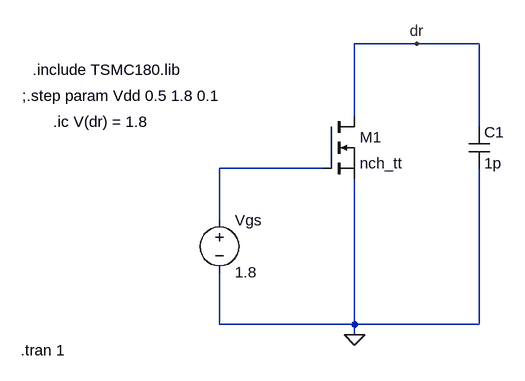
[diagram p0: schematic q1a.asc]
q1a.asc, the LTspice schematic file:
Version 4
SHEET 1 880 680
WIRE 320 0 224 0
WIRE 416 0 320 0
WIRE 224 112 224 0
WIRE 416 128 416 0
WIRE 176 192 16 192
WIRE 16 272 16 192
WIRE 16 432 16 352
WIRE 224 432 224 208
WIRE 224 432 16 432
WIRE 416 432 416 192
WIRE 416 432 224 432
WIRE 224 448 224 432
FLAG 224 448 0
FLAG 320 0 dr
SYMBOL nmos 176 112 R0
SYMATTR InstName M1
SYMATTR Value nch_tt
SYMATTR Value2 l=180n w=240n
SYMBOL voltage 16 256 R0
SYMATTR InstName Vgs
SYMATTR Value 1.8
SYMBOL cap 400 128 R0
SYMATTR InstName C1
SYMATTR Value 1p
TEXT -272 40 Left 2 !.include TSMC180.lib
TEXT -288 80 Left 2 !;.step param Vdd 0.5 1.8 0.1
TEXT -240 120 Left 2 !.ic V(dr) = 1.8
TEXT -290 472 Left 2 !.tran 1

The netlist it stands for:
* q1a.asc
M1 dr N001 0 0 nch_tt l=180n w=240n
Vgs N001 0 1.8
C1 dr 0 1p
.model NMOS NMOS
.model PMOS PMOS
.lib standard.mos
.include TSMC180.lib
;.step param Vdd 0.5 1.8 0.1
.ic V(dr) = 1.8
.tran 1
.backanno
.end